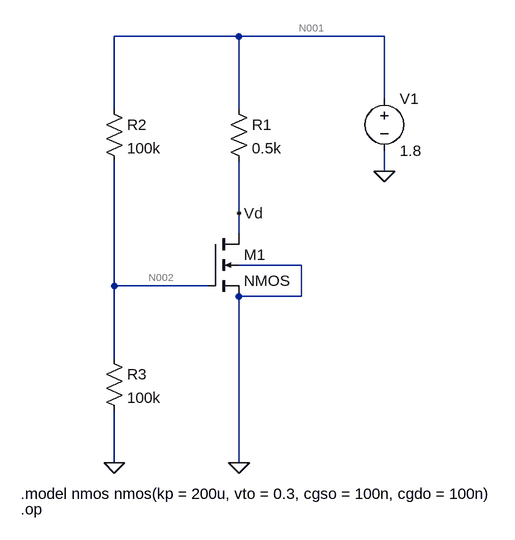
[diagram p0: schematic Operating Point.asc]
Operating Point.asc, the LTspice schematic file:
Version 4
SHEET 1 880 680
WIRE 224 -192 32 -192
WIRE 448 -192 224 -192
WIRE 448 -96 448 -192
WIRE 32 -80 32 -192
WIRE 224 -80 224 -192
WIRE 448 16 448 -16
WIRE 224 80 224 0
WIRE 224 112 224 80
WIRE 320 160 224 160
WIRE 32 192 32 0
WIRE 176 192 32 192
WIRE 320 208 320 160
WIRE 320 208 224 208
WIRE 32 304 32 192
WIRE 32 464 32 384
WIRE 224 464 224 208
FLAG 448 16 0
FLAG 224 464 0
FLAG 32 464 0
FLAG 224 80 Vd
SYMBOL nmos4 176 112 R0
SYMATTR InstName M1
SYMATTR Value2 l=1u w=250u
SYMBOL voltage 448 -112 R0
WINDOW 123 0 0 Left 0
WINDOW 39 0 0 Left 0
SYMATTR InstName V1
SYMATTR Value 1.8
SYMBOL res 208 -96 R0
SYMATTR InstName R1
SYMATTR Value 0.5k
SYMBOL res 16 -96 R0
SYMATTR InstName R2
SYMATTR Value 100k
SYMBOL res 16 288 R0
SYMATTR InstName R3
SYMATTR Value 100k
TEXT -112 512 Left 2 !.model nmos nmos(kp = 200u, vto = 0.3, cgso = 100n, cgdo = 100n)
TEXT -112 536 Left 2 !.op

The netlist it stands for:
* Operating Point.asc
M1 Vd N002 0 0 NMOS l=1u w=250u
V1 N001 0 1.8
R1 N001 Vd 0.5k
R2 N001 N002 100k
R3 N002 0 100k
.model NMOS NMOS
.model PMOS PMOS
.lib standard.mos
.model nmos nmos(kp = 200u, vto = 0.3, cgso = 100n, cgdo = 100n)
.op
.backanno
.end

* Results of the author's LTspice run, read from the files saved beside the schematic
* Operating Point:
*   V(vd) = 124.6 mV
*   V(n002) = 900 mV
*   V(n001) = 1.8 V
*   Id(M1) = 3.351 mA
*   Ig(M1) = 0 A
*   Ib(M1) = -134.6 fA
*   Is(M1) = -3.351 mA
*   I(R3) = 9 µA
*   I(R2) = 9 µA
*   I(R1) = 3.351 mA
*   I(V1) = -3.36 mA
* From the log:
*   Semiconductor Device Operating Points:
*                           --- MOSFET Transistors ---
*   Name:          m1
*   Model:        nmos
*   Id:          3.35e-03
*   Vgs:         9.00e-01
*   Vds:         1.25e-01
*   Vbs:         0.00e+00
*   Vth:         3.00e-01
*   Vdsat:       6.00e-01
*   Gm:          6.23e-03
*   Gds:         2.38e-02
*   Gmb:         0.00e+00
*   Cbd:         0.00e+00
*   Cbs:         0.00e+00
*   Cgsov:       2.50e-11
*   Cgdov:       2.50e-11
*   Cgbov:       0.00e+00
*   Cgs:         0.00e+00
*   Cgd:         0.00e+00
*   Cgb:         0.00e+00